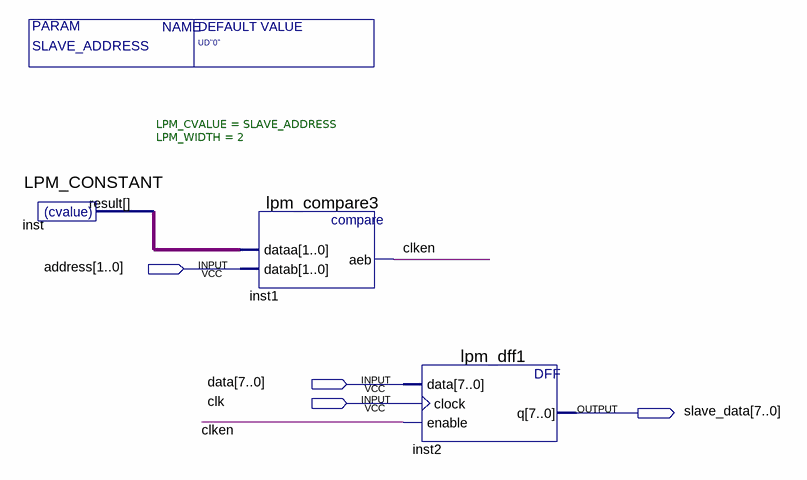
[diagram p0: schematic sheet]
// Quartus schematic slave.bdf as structural Verilog: 3 symbols, 4 pins
module slave #(parameter SLAVE_ADDRESS = "UD\"0\"") (
  input  [1:0] address,
  input  [7:0] data,
  input  clk,
  output [7:0] slave_data
);

  wire clken;
  wire [1:0] inst_result;

  LPM_CONSTANT #(.LPM_CVALUE(SLAVE_ADDRESS), .LPM_WIDTH(2)) inst (.result(inst_result));
  lpm_compare3 inst1 (.dataa(inst_result), .datab(address), .aeb(clken));
  lpm_dff1 inst2 (.data(data), .clock(clk), .enable(clken), .q(slave_data));
endmodule
